# Altium schematic sheet Sensor.SchDoc
size A3; SheetNumber: 1; SheetTotal: 1
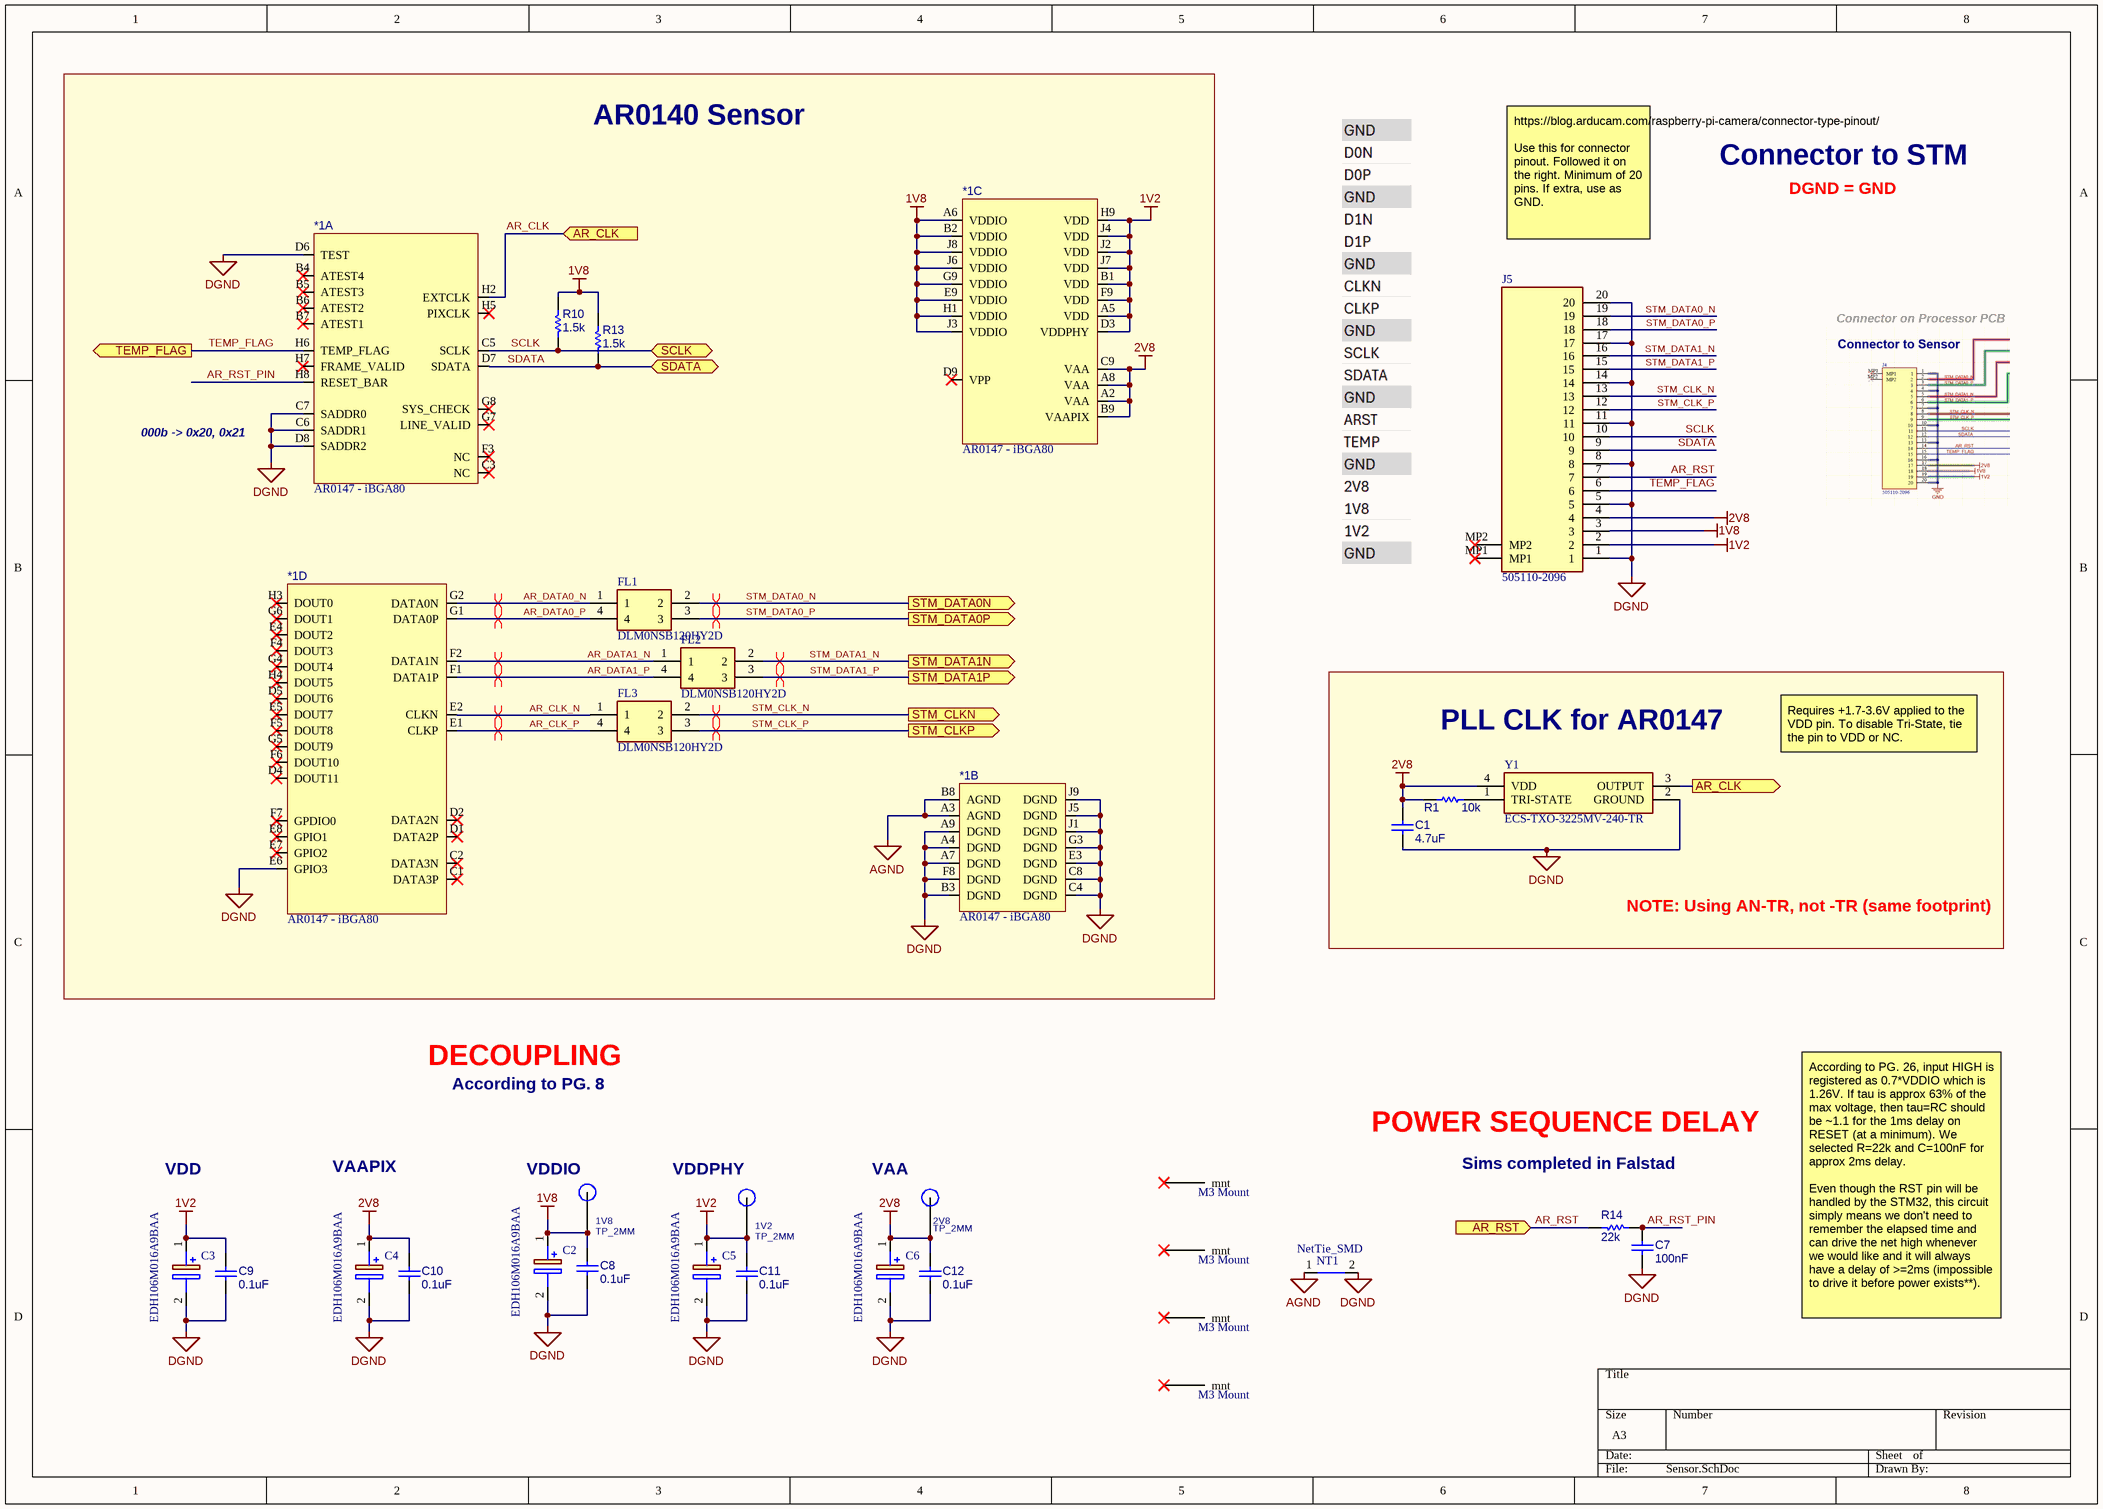
[diagram p0: Sensor.SchDoc]

## Parts
1V2  TP_2MM  [TESTPOINT 2MM]
1V8  TP_2MM  [TESTPOINT 2MM]
2V8  TP_2MM  [TESTPOINT 2MM]
*1  AR0147 - iBGA80  [AR0147 - IBGA80]  (parts A,B,C,D of 4)
C1  value 4.7uF  [C0603]  (hidden comment: MCD-00237)
C2  EDH106M016A9BAA  [EDH106M016A9BAA]
C3  EDH106M016A9BAA  [EDH106M016A9BAA]
C4  EDH106M016A9BAA  [EDH106M016A9BAA]
C5  EDH106M016A9BAA  [EDH106M016A9BAA]
C6  EDH106M016A9BAA  [EDH106M016A9BAA]
C7  value 100nF  [C0603]  (hidden comment: MCD-00237)
C8  value 0.1uF  [C0603]  (hidden comment: MCD-00237)
C9  value 0.1uF  [C0603]  (hidden comment: MCD-00237)
C10  value 0.1uF  [C0603]  (hidden comment: MCD-00237)
C11  value 0.1uF  [C0603]  (hidden comment: MCD-00237)
C12  value 0.1uF  [C0603]  (hidden comment: MCD-00237)
FL1  DLM0NSB120HY2D  [DLM0NSB120HY2D]
FL2  DLM0NSB120HY2D  [DLM0NSB120HY2D]
FL3  DLM0NSB120HY2D  [DLM0NSB120HY2D]
J5  505110-2096  [5051102096]
MNT1  M3 Mount  [M3_Mount-Footprint-1]
MNT2  M3 Mount  [M3_Mount-Footprint-1]
MNT3  M3 Mount  [M3_Mount-Footprint-1]
MNT4  M3 Mount  [M3_Mount-Footprint-1]
NT1  NetTie_SMD  [NETTIE_SMD]  (net tie, no BOM)
R1  value 10k  [RESC1608X55X25ML10T15-1]  (hidden comment: Resistor 10k +/-1% 0603 100mW)
R10  value 1.5k  [RESC1608X55X25ML10T15-1]  (hidden comment: Resistor 10k +/-1% 0603 100mW)
R13  value 1.5k  [RESC1608X55X25ML10T15-1]  (hidden comment: Resistor 10k +/-1% 0603 100mW)
R14  value 22k  [RESC1608X55X25ML10T15-1]  (hidden comment: Resistor 10k +/-1% 0603 100mW)
Y1  ECS-TXO-3225MV-240-TR  [ECSTXO3225MV240TR]

## Blocks framed on the sheet
AR0140 Sensor: *1 FL1-FL3 R10 R13
PLL CLK for AR0147: C1 R1 Y1

## Ports
AR_CLK (in), AR_CLK (out), AR_RST (in), SCLK (bidir), SDATA (bidir), STM_CLKN (out), STM_CLKP (out), STM_DATA0N (out), STM_DATA0P (out), STM_DATA1N (out), STM_DATA1P (out), TEMP_FLAG (out)

## Nets
1V2: 1V2.TP(TP_2MM) *1.A5(VDD) *1.B1(VDD) *1.D3(VDDPHY) *1.F9(VDD) *1.H9(VDD) *1.J2(VDD) *1.J4(VDD) *1.J7(VDD) C3.1(+) C5.1(+) C9.2 C11.2 J5.2
1V8: 1V8.TP(TP_2MM) *1.A6(VDDIO) *1.B2(VDDIO) *1.E9(VDDIO) *1.G9(VDDIO) *1.H1(VDDIO) *1.J3(VDDIO) *1.J6(VDDIO) *1.J8(VDDIO) C2.1(+) C8.2 J5.3 R10.1 R13.1
2V8: 2V8.TP(TP_2MM) *1.A2(VAA) *1.A8(VAA) *1.B9(VAAPIX) *1.C9(VAA) C1.2 C4.1(+) C6.1(+) C10.2 C12.2 J5.4 R1.1 Y1.4(VDD)
AGND: *1.A3(AGND) *1.B8(AGND) NT1.1
DGND: *1.A4(DGND) *1.A7(DGND) *1.A9(DGND) *1.B3(DGND) *1.C4(DGND) *1.C6(SADDR1) *1.C7(SADDR0) *1.C8(DGND) *1.D6(TEST) *1.D8(SADDR2) *1.E3(DGND) *1.E6(GPIO3) *1.F8(DGND) *1.G3(DGND) *1.J1(DGND) *1.J5(DGND) *1.J9(DGND) C1.1 C2.2(-) C3.2(-) C4.2(-) C5.2(-) C6.2(-) C7.1 C8.1 C9.1 C10.1 C11.1 C12.1 J5.1 J5.5 J5.8 J5.11 J5.14 J5.17 J5.20 NT1.2 Y1.2(GROUND)
AR_CLK: *1.H2(EXTCLK) Y1.3(OUTPUT) ; port AR_CLK
AR_CLK_N: *1.E2(CLKN) FL3.1
AR_CLK_P: *1.E1(CLKP) FL3.4
AR_DATA0_N: *1.G2(DATA0N) FL1.1
AR_DATA0_P: *1.G1(DATA0P) FL1.4
AR_DATA1_N: *1.F2(DATA1N) FL2.1
AR_DATA1_P: *1.F1(DATA1P) FL2.4
AR_RST: J5.7 R14.1 ; port AR_RST
AR_RST_PIN: *1.H8(RESET_BAR) C7.2 R14.2
SCLK: *1.C5(SCLK) J5.10 R10.2 ; port SCLK
SDATA: *1.D7(SDATA) J5.9 R13.2 ; port SDATA
STM_CLK_N: FL3.2 J5.13 ; port STM_CLKN
STM_CLK_P: FL3.3 J5.12 ; port STM_CLKP
STM_DATA0_N: FL1.2 J5.19 ; port STM_DATA0N
STM_DATA0_P: FL1.3 J5.18 ; port STM_DATA0P
STM_DATA1_N: FL2.2 J5.16 ; port STM_DATA1N
STM_DATA1_P: FL2.3 J5.15 ; port STM_DATA1P
TEMP_FLAG: *1.H6(TEMP_FLAG) J5.6 ; port TEMP_FLAG
NetR1_2: R1.2 Y1.1(TRI-STATE)

Not connected (* = marked no-connect by the designer): *1 B4(ATEST4)* B5(ATEST3)* B6(ATEST2)* B7(ATEST1)* C1(DATA3P)* C2(DATA3N)* C3(NC)* D1(DATA2P)* D2(DATA2N)* D4(DOUT11)* D5(DOUT6)* D9(VPP)* E4(DOUT2)* E5(DOUT7)* E7(GPIO2)* E8(GPIO1)* F3(NC)* F4(DOUT3)* F5(DOUT8)* F6(DOUT10)* F7(GPDIO0)* G4(DOUT4)* G5(DOUT9)* G6(DOUT1)* G7(LINE_VALID)* G8(SYS_CHECK)* H3(DOUT0)* H4(DOUT5)* H5(PIXCLK)* H7(FRAME_VALID)*; J5 MP1* MP2*; MNT1 1(mnt)*; MNT2 1(mnt)*; MNT3 1(mnt)*; MNT4 1(mnt)*

## Layout directives
differential pair: AR_CLK_N, AR_CLK_P, AR_DATA0_N, AR_DATA0_P, AR_DATA1_N, AR_DATA1_P, STM_CLK_N, STM_CLK_P, STM_DATA0_N, STM_DATA0_P, STM_DATA1_N, STM_DATA1_P

## Notes on the sheet
- Connector to STM
- https://blog.arducam.com/raspberry-pi-camera/connector-type-pinout/
  Use this for connector pinout. Followed it on the right. Minimum of 20 pins. If extra, use as GND.
- DGND = GND
- Connector on Processor PCB
- 000b -> 0x20, 0x21
- Requires +1.7-3.6V applied to the VDD pin. To disable Tri-State, tie the pin to VDD or NC.
- NOTE: Using AN-TR, not -TR (same footprint)
- DECOUPLING
- According to PG. 8
- VDD
- VAAPIX
- (near 1V8) VDDIO
- (near 1V2) VDDPHY
- (near 2V8) VAA
- POWER SEQUENCE DELAY
- Sims completed in Falstad
- According to PG. 26, input HIGH is registered as 0.7*VDDIO which is 1.26V. If tau is approx 63% of the max voltage, then tau=RC should be ~1.1 for the 1ms delay on RESET (at a minimum). We selected R=22k and C=100nF for approx 2ms delay.
  Even though the RST pin will be handled by the STM32, this circuit simply means we don't need to remember the elapsed time and can drive the net high whenever we would like and it will always have a delay of >=2ms (impossible to drive it before power exists**).

## Library data of the parts
C1 C7-C12 = CMP-112-000001-1: Capacitor, MLCC, 100nF, 6V3, X5R, 10%, 0603, T=0,8mm; Manufacturer Part Number: CC0603KRX5R5BB104; Manufacturer: YAGEO; ECCN_EU: NEC; Provided_By: SUBCO; ECCN_US: EAR99; Status: Released; ComponentLink1Description: Datasheet; Component Type: Capacitors; Pin Count: 2; Package: C0603; Source: MB1364.SCHLIB; Design Item ID: MCD-00237; Part_Type: Capacitor; Internal_Part_Number: MCD-00237; ComponentLink1URL: http://tunmcdsvn.tun.st.com/Component_Datasheet_Library/Trunk/Capacitors/Yageo_Multilayer_capacitor_X5R_series_100pF_to_100uF; Manufacturer_Part_Number: CC0603KRX5R5BB104
C2-C6 = EDH106M016A9BAA: Capacitor Polarised; Manufacturer_Name: KEMET; Datasheet Link: https://content.kemet.com/datasheets/KEM_A4049_EDH.pdf; Height: 5.65mm; Manufacturer_Part_Number: EDH106M016A9BAA; Mouser Part Number: 80-EDH106M016A9BAA; Mouser Price/Stock: https://www.mouser.co.uk/ProductDetail/KEMET/EDH106M016A9BAA?qs=iR2ablhfrmGRSCLQdrL4eg%3D%3D; Arrow Part Number: EDH106M016A9BAA; Arrow Price/Stock: https://www.arrow.com/en/products/edh106m016a9baa/kemet-corporation?utm_currency=USD&region=nac
FL1-FL3 = DLM0NSB120HY2D: Filter; Manufacturer_Name: Murata Electronics; Datasheet Link: https://www.murata.com/en-us/products/productdetail?partno=DLM0NSB120HY2%23; Height: 0.5mm; Manufacturer_Part_Number: DLM0NSB120HY2D; Mouser Part Number: 81-DLM0NSB120HY2D; Mouser Price/Stock: https://www.mouser.co.uk/ProductDetail/Murata-Electronics/DLM0NSB120HY2D?qs=d0WKAl%252BL4Kark8uQYdrkog%3D%3D
J5 = 505110-2096: Connector; Manufacturer_Name: Molex; Datasheet Link: https://componentsearchengine.com/Datasheets/1/505110-2096.pdf; Height: 2.1mm; Manufacturer_Part_Number: 505110-2096; Mouser Part Number: 538-505110-2096; Mouser Price/Stock: https://www.mouser.co.uk/ProductDetail/Molex/505110-2096?qs=IvjI65BR3TVK2gHWyfgM0A%3D%3D
MNT1-MNT4 = CMP-002-00124-2: M3 mounting hole; Author: Raphael Ho
NT1 = CMP-018-000019-1: Net Tie SMD; Source: Schematic-Lib-PhilsLab.SchLib; Design Item ID: NetTie_SMD
R1 R10 R13 R14 = CMP-009-00181-1: Chip Resistor, 10k Ohm, 0.1 W, -55 to 155 degC, 0603 (1608 Metric); Voltage Rating: 50V; Tolerance: 1%; Source: Components - 14.11.22 - 11.28.SchLib; Design Item ID: CMP-009-00006-5; Created by: Micah Randall; Power: 100mW; Max Operating Temperature: 155°C; RoHS Compliant: Yes; Mounting Technology: SM; Case/Package: 0603; Min Operating Temperature: -55°C; Pins: 2
Y1 = ECS-TXO-3225MV-240-TR: Crystal or Oscillator; Manufacturer_Name: ECS; Datasheet Link: https://eu.mouser.com/datasheet/2/122/ECS-TXO-3225MV-1634330.pdf; Height: 1.2mm; Manufacturer_Part_Number: ECS-TXO-3225MV-240-TR; Mouser Part Number: 520-TXO-3225MV-240-T; Mouser Price/Stock: https://www.mouser.co.uk/ProductDetail/ECS/ECS-TXO-3225MV-240-TR?qs=d0WKAl%252BL4KYXn7UuwSFJGQ%3D%3D; Arrow Part Number: ECS-TXO-3225MV-240-TR; Arrow Price/Stock: https://www.arrow.com/en/products/ecs-txo-3225mv-240-tr/ecs-international?region=nac